# Altium schematic sheet Sensor_module_envBoard.SchDoc
size A4
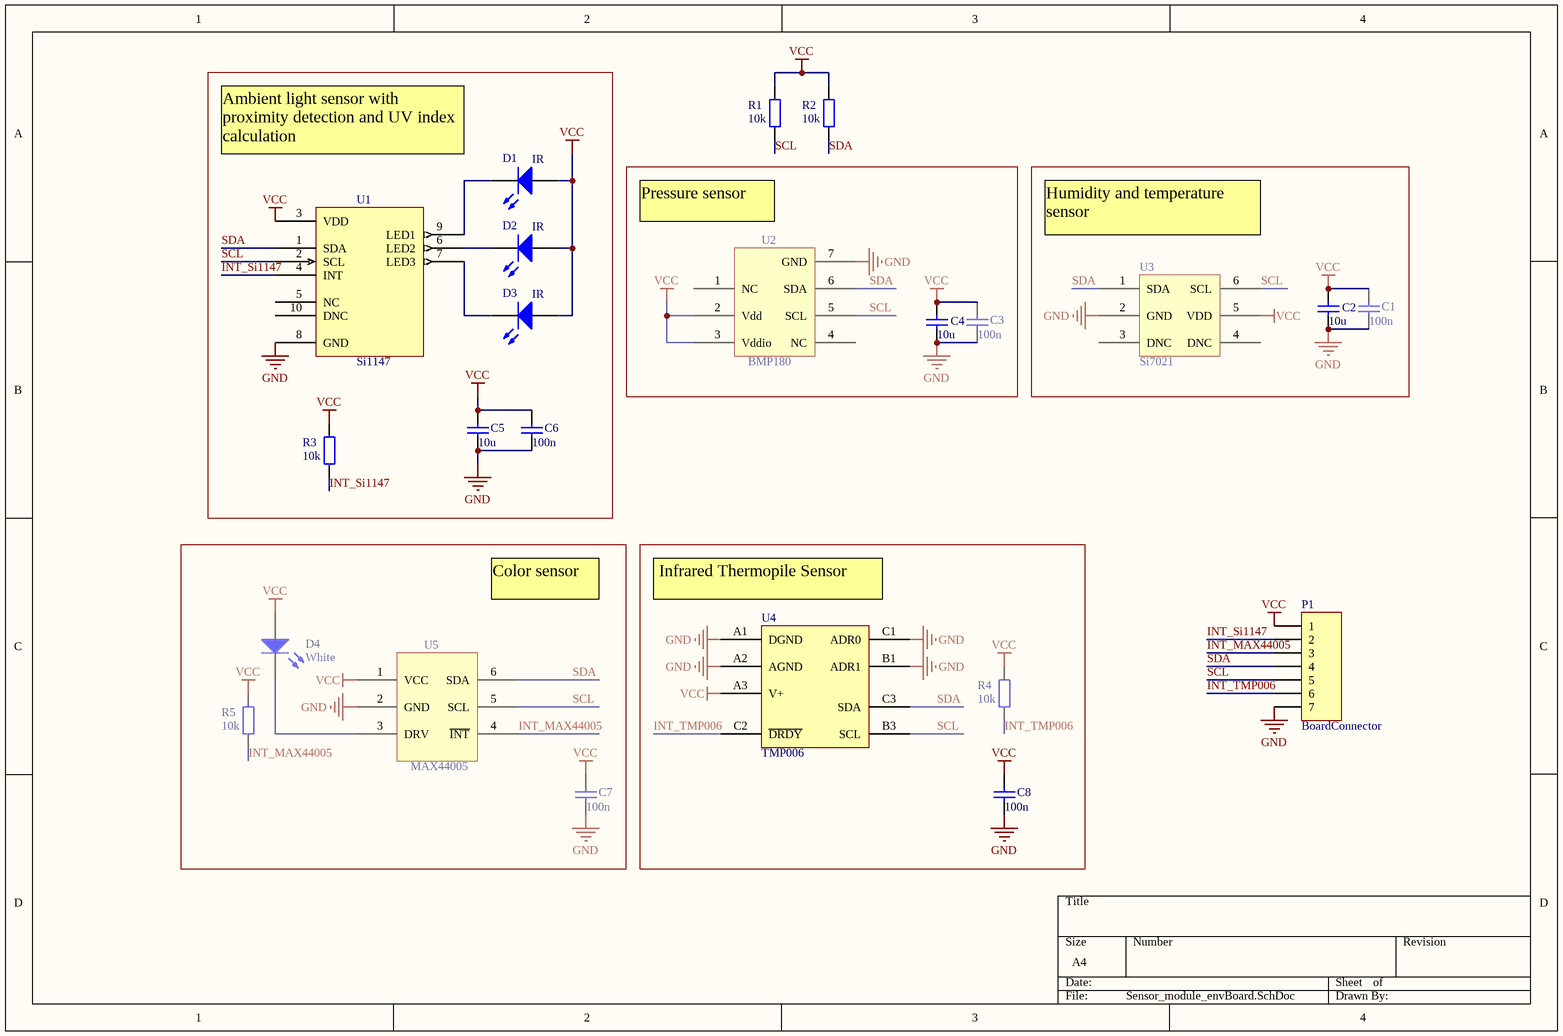
[diagram p0: Sensor_module_envBoard.SchDoc]

## Parts
C1  value 100n  [0402]  (hidden comment: Cap Semi)
C2  10u  [0805]
C3  value 100n  [0402]  (hidden comment: Cap Semi)
C4  10u  [0805]
C5  10u  [0805]
C6  value 100n  [0402]  (hidden comment: Cap Semi)
C7  value 100n  [0402]  (hidden comment: Cap Semi)
C8  value 100n  [0402]  (hidden comment: Cap Semi)
D1  IR  [0603]
D2  IR  [0603]
D3  IR  [0603]
D4  White  [0603]
P1  BoardConnector  [7pin_sensorBoard_connector_]
R1  value 10k  [0402]  (hidden comment: Res2)
R2  value 10k  [0402]  (hidden comment: Res2)
R3  value 10k  [0402]  (hidden comment: Res2)
R4  value 10k  [0402]  (hidden comment: Res2)
R5  value 10k  [0402]  (hidden comment: Res2)
U1  Si1147  [Si1143]
U2  BMP180  [BMP180]
U3  Si7021  [Si7021]
U4  TMP006  [BGA8x3_]
U5  MAX44005  [OTDFN6]

## Nets
GND: C1.1 C2.1 C3.1 C4.1 C5.1 C6.1 C7.1 C8.1 P1.7 U1.8(GND) U2.7(GND) U3.2(GND) U4.A1(DGND) U4.A2(AGND) U4.B1(ADR1) U4.C1(ADR0) U5.2(GND)
VCC: C1.2 C2.2 C3.2 C4.2 C5.2 C6.2 C7.2 C8.2 D1.1(A) D2.1(A) D3.1(A) D4.1(A) P1.1 R1.2 R2.2 R3.2 R4.2 R5.2 U1.3(VDD) U2.2(Vdd) U2.3(Vddio) U3.5(VDD) U4.A3(V+) U5.1(VCC)
INT_MAX44005: P1.3 R5.1 U5.4(~{INT})
INT_Si1147: P1.2 R3.1 U1.4(INT)
INT_TMP006: P1.6 R4.1 U4.C2(~{DRDY})
SCL: P1.5 R1.1 U1.2(SCL) U2.5(SCL) U3.6(SCL) U4.B3(SCL) U5.5(SCL)
SDA: P1.4 R2.1 U1.1(SDA) U2.6(SDA) U3.1(SDA) U4.C3(SDA) U5.6(SDA)
NetD1_2: D1.2(K) U1.9(LED1)
NetD2_2: D2.2(K) U1.6(LED2)
NetD3_2: D3.2(K) U1.7(LED3)
NetD4_2: D4.2(K) U5.3(DRV)

Not connected (* = marked no-connect by the designer): U1 5(NC) 10(DNC); U2 1(NC) 4(NC); U3 3(DNC) 4(DNC)

## Notes on the sheet
- Ambient light sensor with proximity detection and UV index calculation
- Pressure sensor
- Humidity and temperature sensor
- Color sensor
- (near U4) Infrared Thermopile Sensor

## Library data of the parts
C1-C8 = Cap Semi: Capacitor (Semiconductor SIM Model); Published: 8-Jun-2000; LatestRevisionDate: 29-May-2009; LatestRevisionNote: IPC-7351 Footprint Added.; PackageReference: C1206; Publisher: Altium Limited; PackageDescription: Chip Capacitor
  C2 C4 C5: Value: 10u
D1-D4 = LED0: Typical INFRARED GaAs LED; Published: 8-Jun-2000; LatestRevisionDate: 08-Jul-2005; LatestRevisionNote: Mech Layer 1 removed.; PackageReference: LED-0; Publisher: Altium Limited; PackageDescription: LED; 2 Leads
P1 = Header 7: Header, 7-Pin; LatestRevisionDate: 17-Jul-2002; LatestRevisionNote: Re-released for DXP Platform.; Publisher: Altium Limited
R1-R5 = Res2: Resistor; Published: 8-Jun-2000; LatestRevisionDate: 17-Jul-2002; LatestRevisionNote: Re-released for DXP Platform.; PackageReference: AXIAL-0.4; Publisher: Altium Limited; PackageDescription: Axial Device, Thru-Hole; 2 Leads; 0.4 in Pin Spacing
U1 = Si1143